# Altium schematic sheet Telemetry Hat.SchDoc
size A4; SheetNumber: 1; SheetTotal: 1
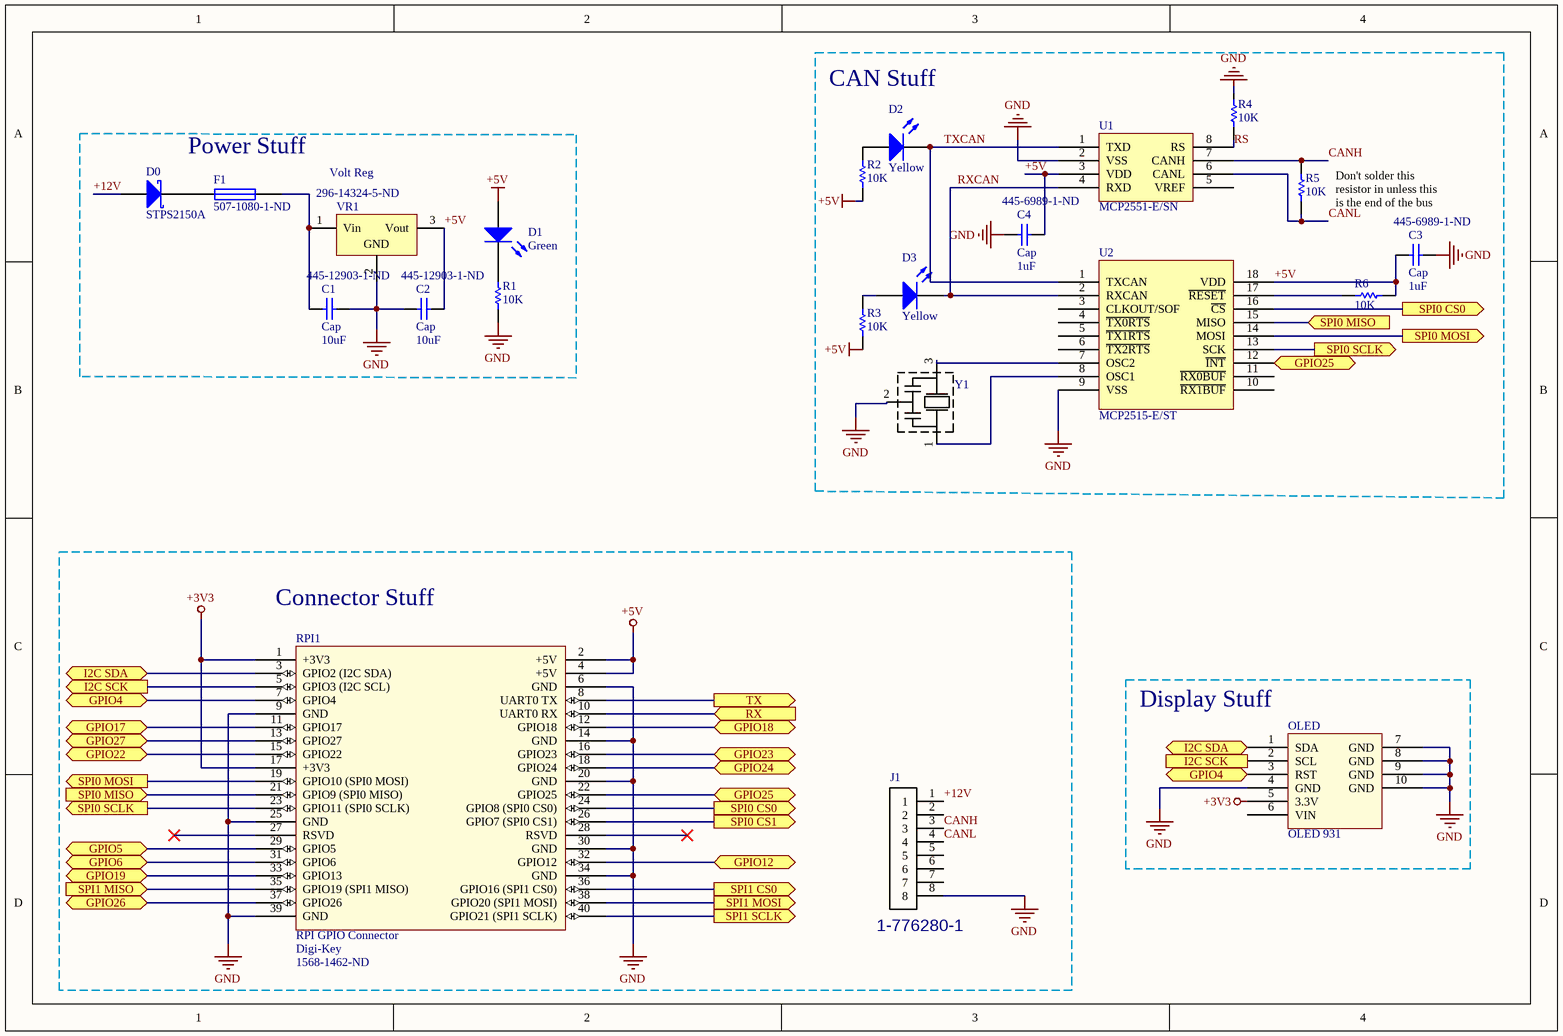
[diagram p0: Telemetry Hat.SchDoc]

## Parts
C1  Cap  value 10uF  Supplier Part Number 1: 445-12903-1-ND  [1206]
C2  Cap  value 10uF  Supplier Part Number 1: 445-12903-1-ND  [1206]
C3  Cap  value 1uF  Supplier Part Number 1: 445-6989-1-ND  [1206]
C4  Cap  value 1uF  Supplier Part Number 1: 445-6989-1-ND  [1206]
D0  STPS2150A  [STM-SMA-2_B_V]
D1  Green  [LEDC3216X120NGRN]
D2  Yellow  [LEDC3216X120NYEL]
D3  Yellow  [LEDC3216X120NYEL]
F1  507-1080-1-ND  [1206]
J1  1-776280-1  [*TE_1-776280-1]
OLED  OLED 931  [OLED]
R1  10K  [RESC3216X60N]
R2  10K  [RESC3216X60N]
R3  10K  [RESC3216X60N]
R4  10K  [RESC3216X60N]
R5  10K  [RESC3216X60N]
R6  10K  [RESC3216X60N]
RPI1  RPI GPIO Connector  Supplier 1: Digi-Key  Supplier Part Number 1: 1568-1462-ND  [rpi]
U1  MCP2551-E/SN  [SOIC127P600X175-8N]
U2  MCP2515-E/ST  [SOIC127P1030X265-18N]
VR1  Volt Reg  Supplier Part Number 1: 296-14324-5-ND  [Regulator]
Y1  CSTCE16M0V53-R0  [CSTCE_G]  (value not drawn)

## Blocks framed on the sheet
CAN Stuff: C3 C4 D2 D3 R2-R6 U1 U2 Y1
Power Stuff: C1 C2 D0 D1 F1 R1 VR1
Connector Stuff: J1 RPI1
Display Stuff: OLED

## Ports
GPIO4 (bidir), GPIO5 (bidir), GPIO6 (bidir), GPIO12 (bidir), GPIO17 (bidir), GPIO18 (bidir), GPIO19 (bidir), GPIO22 (bidir), GPIO23 (bidir), GPIO24 (bidir), GPIO25 (bidir), GPIO26 (bidir), GPIO27 (bidir), I2C SCK (out), I2C SDA (bidir), RX (in), SPI0 CS0 (out), SPI0 CS1 (out), SPI0 MISO (in), SPI0 MOSI (out), SPI0 SCLK (out), SPI1 CS0 (out), SPI1 MISO (in), SPI1 MOSI (out), SPI1 SCLK (out), TX (out)

## Nets
+3V3: OLED.5(3.3V) RPI1.1(+3V3) RPI1.17(+3V3)
+5V: C2.2 C3.1 C4.2 D1.1(A) R2.1 R3.2 R6.2 RPI1.2(+5V) RPI1.4(+5V) U1.3(VDD) U2.18(VDD) VR1.3(Vout)
GND: C1.2 C2.1 C3.2 C4.1 J1.8 OLED.4(GND) OLED.7(GND) OLED.8(GND) OLED.9(GND) OLED.10(GND) R1.2 R4.1 RPI1.6(GND) RPI1.9(GND) RPI1.14(GND) RPI1.20(GND) RPI1.25(GND) RPI1.30(GND) RPI1.34(GND) RPI1.39(GND) U1.2(VSS) U2.9(VSS) VR1.2(GND) Y1.2
+12V: D0.1(A) J1.1
CANH: J1.3 R5.1 U1.7(CANH)
CANL: J1.4 R5.2 U1.6(CANL)
GPIO4: OLED.3(RST) RPI1.7(GPIO4) ; port GPIO4
GPIO5: RPI1.29(GPIO5) ; port GPIO5
GPIO6: RPI1.31(GPIO6) ; port GPIO6
GPIO12: RPI1.32(GPIO12) ; port GPIO12
GPIO17: RPI1.11(GPIO17) ; port GPIO17
GPIO18: RPI1.12(GPIO18) ; port GPIO18
GPIO19: RPI1.33(GPIO13) ; port GPIO19
GPIO22: RPI1.15(GPIO22) ; port GPIO22
GPIO23: RPI1.16(GPIO23) ; port GPIO23
GPIO24: RPI1.18(GPIO24) ; port GPIO24
GPIO25: RPI1.22(GPIO25) U2.12(~{INT}) ; port GPIO25
GPIO26: RPI1.37(GPIO26) ; port GPIO26
GPIO27: RPI1.13(GPIO27) ; port GPIO27
I2C SCK: OLED.2(SCL) RPI1.5(GPIO3_(I2C_SCL)) ; port I2C SCK
I2C SDA: OLED.1(SDA) RPI1.3(GPIO2_(I2C_SDA)) ; port I2C SDA
RS: R4.2 U1.8(RS)
RX: RPI1.10(UART0_RX) ; port RX
RXCAN: D3.2(K) U1.4(RXD) U2.2(RXCAN)
SPI0 CS0: RPI1.24(GPIO8_(SPI0_CS0)) U2.16(~{CS}) ; port SPI0 CS0
SPI0 CS1: RPI1.26(GPIO7_(SPI0_CS1)) ; port SPI0 CS1
SPI0 MISO: RPI1.21(GPIO9_(SPI0_MISO)) U2.15(MISO) ; port SPI0 MISO
SPI0 MOSI: RPI1.19(GPIO10_(SPI0_MOSI)) U2.14(MOSI) ; port SPI0 MOSI
SPI0 SCLK: RPI1.23(GPIO11_(SPI0_SCLK)) U2.13(SCK) ; port SPI0 SCLK
SPI1 CS0: RPI1.36(GPIO16_(SPI1_CS0)) ; port SPI1 CS0
SPI1 MISO: RPI1.35(GPIO19_(SPI1_MISO)) ; port SPI1 MISO
SPI1 MOSI: RPI1.38(GPIO20_(SPI1_MOSI)) ; port SPI1 MOSI
SPI1 SCLK: RPI1.40(GPIO21_(SPI1_SCLK)) ; port SPI1 SCLK
TX: RPI1.8(UART0_TX) ; port TX
TXCAN: D2.2(K) U1.1(TXD) U2.1(TXCAN)
NetC1_1: C1.1 F1.2 VR1.1(Vin)
NetD0_2: D0.2(K) F1.1
NetD1_2: D1.2(K) R1.1
NetD2_1: D2.1(A) R2.2
NetD3_1: D3.1(A) R3.1
NetR6_1: R6.1 U2.17(~{RESET})
NetU2_7: U2.7(OSC2) Y1.3
NetU2_8: U2.8(OSC1) Y1.1

Not connected (* = marked no-connect by the designer): J1 2 5 6 7; OLED 6(VIN); RPI1 27(RSVD)* 28(RSVD)*; U1 5(VREF); U2 3(CLKOUT/SOF) 4(~{TX0RTS}) 5(~{TX1RTS}) 6(~{TX2RTS}) 10(~{RX1BUF}) 11(~{RX0BUF})

## Notes on the sheet
- Don't solder this resistor in unless this is the end of the bus

## Library data of the parts
C1-C4 = Cap: Capacitor; Published: 8-Jun-2000; LatestRevisionDate: 17-Jul-2002; LatestRevisionNote: Re-released for DXP Platform.; PackageReference: RAD-0.3; Publisher: Altium Limited; PackageDescription: Radial Cap, Thru-Hole; 2 Leads; 0.3 in Pin Spacing; Supplier 1: Digi-Key
D0 = CMP-2000-07174-1: Power Schottky Rectifier, 150 V, 2 A, 2-Pin SMD, RoHS, Tape and Reel; Manufacturer: STMicroelectronics; Other Names: 497-2467-6; Voltage - Forward (Vf) (Max) @ If: 820mV@2A; Current - Reverse Leakage @ Vr: 1.5µA@150V; Voltage - DC Reverse (Vr) (Max): 150V; Other Related Documents: STPS2150ViewAllSpecifications; Online Catalog: SchottkyDiode; Speed: FastRecovery=200mA(Io); Current - Average Rectified (Io): 2A; Capacitance @ Vr, F: -; Mounting Type: SurfaceMount; Diode Type: Schottky; Supplier Device Package: SMA(DO-214AC); Package Reference: SMA; Datasheet URL: http://www.st.com/content/ccc/resource/technical/document/datasheet/61/59/17/ff/5b/58/43/45/CD00003322.pdf/files/CD00003322.pdf/jcr:content/translations/en.CD00003322.pdf; Category: DiscreteSemiconductorProducts; Reverse Recovery Time (trr): -; Mounting Technology: SurfaceMount; Operating Temperature - Junction: 175°C(Max); Manufacturer URL: http://www.st.com/; Series: -; Family: Diodes,Rectifiers-Single; Datasheet Version: Rev. 6, 09/2008; Packaging: Digi-Reel®; Package Description: 2-Pin Surface Mount Device, Body 4.275 x 2.575 mm; Standard Package: 1; Package / Case: DO-214AC,SMA
D1 = LED2: Typical RED, GREEN, YELLOW, AMBER GaAs LED; Manufacturer: Broadcom Avago; Manufacturer Part Number: HSMG-C150; Lens Colour: White,Clear; Viewing Angle: 170°; Lens Style: Diffused,Colorless,Rectangular; Luminous Intensity: 15mcd; Forward Voltage: 2.2V; Forward Current: 20mA; Wavelength: 572nm; Number of LEDs: 1; Power Rating: 65mW; Reverse Voltage: 5V; Lens Transparency: Diffused; Published: 8-Jun-2000; LatestRevisionDate: 17-Jul-2002; LatestRevisionNote: Re-released for DXP Platform.; PackageVersion: Feb-2002; PackageReference: 3.2X1.6X1.1; Publisher: Altium Limited; PackageDescription: SM LED; 2 Flat Leads; Mount: Surface Mount; Case/Package: 1206; Number of Pins: 2; Colour: Green,Yellow; Case Code (Metric): 3216; Case Code (Imperial): 1206; Contact Plating: Gold; Min Operating Temperature: -30°C; Max Operating Temperature: 85°C; Packaging: Tape and Reel; Package Quantity: 1; Illumination Colour: Green; Dominant Wavelength: 572nm; Test Current: 20mA; Number of Elements: 1; Power Dissipation: 65mW; Max Power Dissipation: 65mW; Length: 3.2mm; Height: 1.1mm; Width: 1.6mm; Depth: 1.6mm; Radiation Hardening: No; REACH SVHC: No SVHC; ComponentLink1URL: https://datasheet.ciiva.com/11774/0900766b804a6539-11774272.pdf; ComponentLink1Description: https://datasheet.ciiva.com/11774/0900766b804a6539-11774272.pdf; ComponentLink2URL: https://datasheet.ciiva.com/14172/swseriehsmx-c150toc190-e-14172162.pdf; ComponentLink2Description: https://datasheet.ciiva.com/14172/swseriehsmx-c150toc190-e-14172162.pdf; ComponentLink3URL: https://datasheet.ciiva.com/46426/313031-46426517.pdf; ComponentLink3Description: https://datasheet.ciiva.com/46426/313031-46426517.pdf; ComponentLink4URL: https://datasheet.ciiva.com/15117/getdatasheetpartid-110366-15117482.pdf; ComponentLink4Description: https://datasheet.ciiva.com/15117/getdatasheetpartid-110366-15117482.pdf; ComponentLink5URL: https://datasheet.ciiva.com/19466/1556369-19466015.pdf; ComponentLink5Description: https://datasheet.ciiva.com/19466/1556369-19466015.pdf; ComponentLink6URL: https://datasheet.ciiva.com/29280/180668-da-01-en-chip-led-hsmg-c150-gelb-gruen-29280632.pdf; ComponentLink6Description: https://datasheet.ciiva.com/29280/180668-da-01-en-chip-led-hsmg-c150-gelb-gruen-29280632.pdf; Supplier 1: Digi-Key; Supplier 2: Digi-Key; Supplier Part Number: 732-4993-1-ND
D2 D3 = LED2_1: Typical RED, GREEN, YELLOW, AMBER GaAs LED; Manufacturer: Broadcom Avago; Manufacturer Part Number: HSMY-C150; Lens Colour: White,Clear; Viewing Angle: 170°; Lens Style: Diffused,Colorless,Rectangular; Wavelength: 586nm; Luminous Intensity: 8mcd; Forward Current: 20mA; Forward Voltage: 2.1V; Number of LEDs: 1; Reverse Voltage: 5V; Power Dissipation: 65mW; Lens Transparency: Diffused; Published: 8-Jun-2000; LatestRevisionDate: 17-Jul-2002; LatestRevisionNote: Re-released for DXP Platform.; PackageVersion: Feb-2002; PackageReference: 3.2X1.6X1.1; Publisher: Altium Limited; PackageDescription: SM LED; 2 Flat Leads; Supplier 1: Digi-Key; Stock 1: 0; Mount: Surface Mount; Case/Package: 1206; Number of Pins: 2; Colour: Yellow; Case Code (Metric): 3216; Case Code (Imperial): 1206; Contact Plating: Gold; Min Operating Temperature: -40°C; Max Operating Temperature: 85°C; Packaging: Tape and Reel; Package Quantity: 1; Illumination Colour: Yellow; Dominant Wavelength: 586nm; Test Current: 20mA; Number of Elements: 1; Power Rating: 65mW; Max Power Dissipation: 65mW; Voltage Rating (DC): 2.1V; Length: 3.2mm; Height: 1.1mm; Width: 1.6mm; Depth: 1.6mm; Radiation Hardening: No; REACH SVHC: No SVHC; Lead Free: Lead Free; ComponentLink1URL: https://datasheet.ciiva.com/15117/getdatasheetpartid-110528-15117488.pdf; ComponentLink1Description: https://datasheet.ciiva.com/15117/getdatasheetpartid-110528-15117488.pdf; ComponentLink2URL: https://datasheet.ciiva.com/11774/0900766b804a6539-11774578.pdf; ComponentLink2Description: https://datasheet.ciiva.com/11774/0900766b804a6539-11774578.pdf; ComponentLink3URL: https://datasheet.ciiva.com/19466/1557071-19466435.pdf; ComponentLink3Description: https://datasheet.ciiva.com/19466/1557071-19466435.pdf; ComponentLink4URL: https://datasheet.ciiva.com/14172/swseriehsmx-c150toc190-e-14172159.pdf; ComponentLink4Description: https://datasheet.ciiva.com/14172/swseriehsmx-c150toc190-e-14172159.pdf; ComponentLink5URL: https://datasheet.ciiva.com/29280/180507-da-01-en-chip-led-hsmy-c150-gelb-29280997.pdf; ComponentLink5Description: https://datasheet.ciiva.com/29280/180507-da-01-en-chip-led-hsmy-c150-gelb-29280997.pdf; Supplier 2: Digi-Key; Supplier Part Number: 732-4994-1-ND
F1 = Fuse 1: Fuse; Published: 8-Jun-2000; LatestRevisionDate: 17-Jul-2002; LatestRevisionNote: Re-released for DXP Platform.; PackageReference: PIN-W2/E2.8; Publisher: Altium Limited; PackageDescription: Thru-Hole; 2 Leads; ComponentLink1Description: digikey; ComponentLink1URL: https://www.digikey.ca/product-detail/en/bel-fuse-inc/0686F2500-01/507-2151-1-ND/7427703
J1 = 1-776280-1: AMPSEAL 8 Position Three Row 0.157 inch Right Angle Sealed Pin Header; MF: TE Connectivity; TE_purchase_URL: https://www.te.com/usa-en/product-1-776280-1.html?te_bu=Cor&te_type=disp&te_campaign=seda_glo_cor-seda-global-disp-prtnr-fy19-seda-model-bom-cta_sma-317_1&elqCampaignId=32493; Digi-Key_Purchase_URL: https://www.digikey.com/product-detail/en/te-connectivity-deutsch-connectors/1-776280-1/1734-1-776280-1-ND/5428578?utm_source=snapeda&utm_medium=aggregator&utm_campaign=symbol; Digi-Key_Part_Number: 1734-1-776280-1-ND; Package: None; MP: 1-776280-1; EU_RoHS_Compliance: Compliant; SnapEDA_Link: https://www.snapeda.com/parts/1-776280-1/TE%20Connectivity%20AMP%20Connectors/view-part/1263371/?ref=snap; Value: *
OLED = OLED Adafruit 931
R1-R4 R6 = Res1: Resistor; Manufacturer: Stackpole Electronics; Manufacturer Part Number: RNCP1206FTD1K00; Resistance: 10kR; Tolerance: 1%; Temperature Coefficient: 100ppm/°C; Max Power Dissipation: 500mW; Value: 10K; Supplier Part Number: RNCP1206FTD10K0CT-ND; Supplier 1: Digi-Key; Stock 1: 679; Pricing 1: 1=0.1, 10=0.052, 100=0.0211, 1000=0.00949, 2500=0.00824 (USD); Mount: Surface Mount; Case/Package: 1206; Case Code (Metric): 3216; Case Code (Imperial): 1206; Contact Plating: Nickel,Tin,Matte; Min Operating Temperature: -55°C; Max Operating Temperature: 155°C; Packaging: Tape and Reel; Composition: Thin Film; Number of Terminations: 2; Length: 0.122inch; Height: 0.024inch; Width: 0.059inch; Radiation Hardening: No; Lead Free: Lead Free; ComponentLink1URL: http://www.seielect.com/Catalog/SEI-rncp.pdf; ComponentLink1Description: http://www.seielect.com/Catalog/SEI-rncp.pdf; ComponentLink2URL: https://www.seielect.com/catalog/SEI-Packaging.pdf; ComponentLink2Description: https://www.seielect.com/catalog/SEI-Packaging.pdf
R5 = Res1: Resistor; Manufacturer: Stackpole Electronics; Manufacturer Part Number: RNCP1206FTD1K00; Resistance: 10kR; Temperature Coefficient: 100ppm/°C; Tolerance: 1%; Max Power Dissipation: 500mW; Value: 10K; Supplier 1: Digi-Key; Stock 1: 679; Case/Package: 1206; Case Code (Imperial): 1206; Case Code (Metric): 3216; Contact Plating: Nickel,Tin,Matte; Min Operating Temperature: -55°C; Max Operating Temperature: 155°C; Packaging: Tape and Reel; Composition: Thin Film; Length: 0.122inch; Height: 0.024inch; Width: 0.059inch; Radiation Hardening: No; Lead Free: Lead Free; ComponentLink1URL: http://www.seielect.com/Catalog/SEI-rncp.pdf; ComponentLink1Description: http://www.seielect.com/Catalog/SEI-rncp.pdf; ComponentLink2URL: https://www.seielect.com/catalog/SEI-Packaging.pdf; ComponentLink2Description: https://www.seielect.com/catalog/SEI-Packaging.pdf; Supplier Part Number: RNCP1206FTD10K0CT-ND; Pricing 1: 1=0.1, 10=0.052, 100=0.0211, 1000=0.00949, 2500=0.00824 (USD); Mount: Surface Mount; Number of Terminations: 2
RPI1 = rpi connector: GPIO Header for Raspberry Pi A+/B+/Pi 2/Pi 3 - 2x20; Manufacturer: SparkFun Electronics; Manufacturer Part Number: PRT-14017; Nils Minor: author; nilsminor@web.de: mail; RoHS: RoHS Compliant; Category: Development Boards, Kits, Programmers; Stock 1: 150; Pricing 1: 1=1.84 (EUR); Part Status: Active; Accessory Type: Connector; For Use With/Related Products: Raspberry Pi; ComponentLink1URL: https://cdn.sparkfun.com/datasheets/Dev/RaspberryPi/12313.pdf; ComponentLink1Description: https://cdn.sparkfun.com/datasheets/Dev/RaspberryPi/12313.pdf
U1 = MCP2551-E/SN: SOIC; Supplier 1: Digi-Key; Supplier Part Number: MCP2551T-E/SNCT-ND
U2 = MCP2515-E/ST: SOIC; Supplier 1: Digi-Key; Supplier Part Number: MCP2515T-I/SOCT-ND
VR1 = Volt Reg: Voltage Regulator; Published: 24-Mar-1999; LatestRevisionDate: 29-May-2009; LatestRevisionNote: IPC-7351 Footprint Added.; PackageReference: D2PAK; Publisher: Altium Limited; PackageDescription: 3-Pin Transistor Outline Package 2.54 mm Pitch, 15.1 mm Lead Span; Supplier 1: Digi-Key
Y1 = CSTCE16M0V53-R0: Manufacturer: Murata; Manufacturer Part Number: CSTCE16M0V53C-R0; Frequency: 16MHz; Frequency Tolerance: 0.5%; Frequency Stability: 0.15%; Capacitance: 15pF; Supplier Part Number: 490-17948-1-ND; Supplier 1: Digi-Key; Stock 1: 0; Mount: Surface Mount; Case/Package: SMD/SMT; Number of Pins: 3; Contact Plating: Gold; Min Operating Temperature: -40°C; Max Operating Temperature: 125°C; Packaging: Tape and Reel; Composition: Ceramic; Package Quantity: 3000; Termination: SMD/SMT; Tolerance: 0.5%; Length: 0.126inch; Height: 0.031inch; Width: 0.051inch; REACH SVHC: No SVHC; Lead Free: Lead Free; ComponentLink1URL: https://datasheet.ciiva.com/16430/cstce16m0v53c-r0-16430704.pdf; ComponentLink1Description: https://datasheet.ciiva.com/16430/cstce16m0v53c-r0-16430704.pdf; ComponentLink2URL: https://datasheet.ciiva.com/14132/ceralock-eng-bro-14132709.pdf; ComponentLink2Description: https://datasheet.ciiva.com/14132/ceralock-eng-bro-14132709.pdf; ComponentLink3URL: https://datasheet.ciiva.com/29617/l0430e-29617948.pdf; ComponentLink3Description: https://datasheet.ciiva.com/29617/l0430e-29617948.pdf; ComponentLink4URL: https://datasheet.ciiva.com/29617/l0430e-29617949.pdf; ComponentLink4Description: https://datasheet.ciiva.com/29617/l0430e-29617949.pdf; ComponentLink5URL: https://datasheet.ciiva.com/29617/l0430e-29617950.pdf; ComponentLink5Description: https://datasheet.ciiva.com/29617/l0430e-29617950.pdf; ComponentLink6URL: https://datasheet.ciiva.com/26812/getdatasheetpartid-418508-26812063.pdf; ComponentLink6Description: https://datasheet.ciiva.com/26812/getdatasheetpartid-418508-26812063.pdf